# EAGLE design MJ808 clone - all driver- POC (EAGLE 9.4.0)
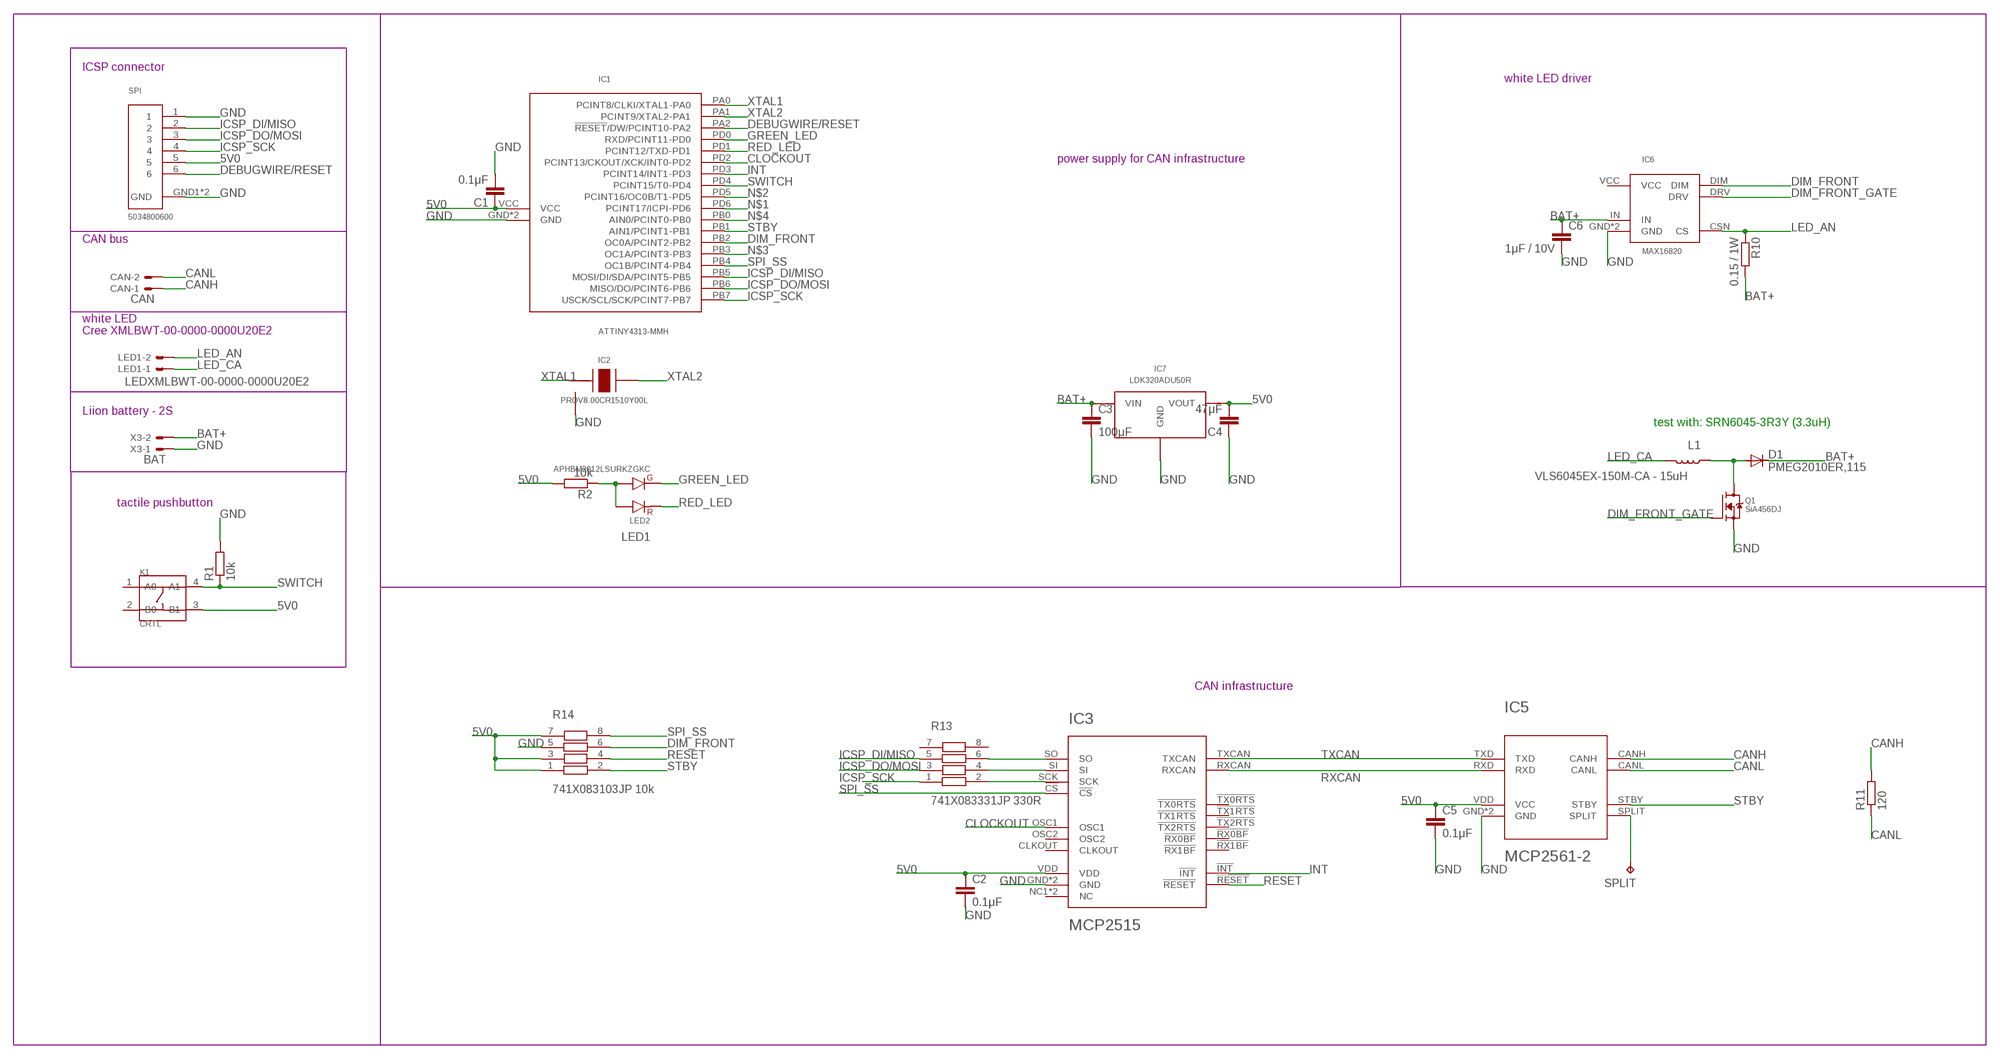
[diagram p0: schematic, sheet 1]

## Parts
C1  0.1μF  C-EUC0402  [C0402]
C2  0.1μF  C-EUC0402  [C0402]
C3  100μF  C-EUC1206  [C1206]
C4  47μF  C-EUC0805  [C0805]
C5  0.1μF  C-EUC0402  [C0402]
C6  1μF / 10V  C-EUC0805  [C0805]
CAN  CAN  22-23-2021  [22-23-2021]
D1  PMEG2010ER,115  DIODE-SOD123  [SOD123]
IC1  ATTINY4313-MMH  ATTINY4313VQFN-20  [VQFN-20]
IC2  PRQV8.00CR1510Y00L  PRQV  [SMT]
IC3  MCP2515  MCP2515-I-ML  [QFN20]
IC5  MCP2561-2  [DFN10]
IC6  MAX16820  [TDFN-6-EP]
IC7  LDK320ADU50R  LDO  [SOT-89]
K1  CRTL  SMD-SWITCH-TACTILE-SPST-NO(4P-D6.0MM)  [SW4-SMD-6.0X6.0X5.0MM]
L1  VLS6045EX-150M-CA - 15uH  INDUCTOR-SRN6045-33UH  [SRN6045]
LED1  LEDXMLBWT-00-0000-0000U20E2  22-23-2021  [22-23-2021]
LED2  APHBM2012LSURKZGKC  [SMD]
Q1  SiA456DJ  SIA456DJ  [SC-70-6]
R1  10k  R-EU_R0402  [R0402]
R2  10k  R-EU_R0402  [R0402]
R10  0.15 / 1W  R-EU_R1210  [R1210]
R11  120  R-EU_R0805  [R0805]
R13  741X083331JP 330R  741X083331JP  [0402]
R14  741X083103JP 10k  741X083331JP  [0402]
SPI  5034800600  [SMT]
SPLIT  TPB2,54  [B2,54]
X3  BAT  22-23-2021  [22-23-2021]

## Nets
5V0 [5V0_μC]: C1.1 C2.1 C4.2 C5.1 IC1.VCC IC3.VDD IC5.VDD(VCC) IC7.VOUT K1.3(B1) R2.2 R14.1 R14.3 R14.7 SPI.5
BAT+ [currett-0.45]: C3.1 C6.1 D1.C IC6.IN IC7.VIN R10.2 X3.2
CANH [signal]: CAN.1 IC5.CANH R11.2
CANL [signal]: CAN.2 IC5.CANL R11.1
CLOCKOUT [signal]: IC1.PD2(PCINT13/CKOUT/XCK/INT0-PD2) IC3.OSC1
DEBUGWIRE/RESET [signal]: IC1.PA2(!RESET!/DW/PCINT10-PA2) SPI.6
DIM_BRAKE_DRAIN: D1.A L1.1 Q1.D
DIM_FRONT [signal]: IC1.PB2(OC0A/PCINT2-PB2) IC6.DIM R14.6
DIM_FRONT_GATE [signal]: IC6.DRV Q1.G
GND: C1.2 C2.2 C3.2 C4.1 C5.2 C6.2 IC1.GND IC1.GND1(GND) IC2.GND IC3.GND IC3.GND6(GND) IC5.GND IC5.VSS(GND) IC6.GND IC6.GND1(GND) IC7.GND Q1.S R1.2 R14.5 SPI.1 SPI.GND1(GND) SPI.GND2(GND) X3.1
GREEN_LED [signal]: IC1.PD0(RXD/PCINT11-PD0) LED2.3
ICSP_DI/MISO [signal]: IC1.PB5(MOSI/DI/SDA/PCINT5-PB5) R13.5 SPI.2
ICSP_DO/MOSI [signal]: IC1.PB6(MISO/DO/PCINT6-PB6) R13.3 SPI.3
ICSP_SCK [signal]: IC1.PB7(USCK/SCL/SCK/PCINT7-PB7) R13.1 SPI.4
INT [signal]: IC1.PD3(PCINT14/INT1-PD3) IC3.!INT!
LED1 [signal]: LED2.1 LED2.4 R2.1
LED_AN [currett-0.45]: IC6.CSN(CS) LED1.2 R10.1
LED_CA: L1.2 LED1.1
N$1: IC1.PD6(PCINT17/ICPI-PD6)
N$2: IC1.PD5(PCINT16/OC0B/T1-PD5)
N$3: IC1.PB3(OC1A/PCINT3-PB3)
N$4: IC1.PB0(AIN0/PCINT0-PB0)
RED_LED [signal]: IC1.PD1(PCINT12/TXD-PD1) LED2.2
RESET [signal]: IC3.!RESET! R14.4
RXCAN [signal]: IC3.RXCAN IC5.RXD
SPI_MISO [signal]: IC3.SO R13.6
SPI_MOSI [signal]: IC3.SI R13.4
SPI_SCK [signal]: IC3.SCK R13.2
SPI_SS [signal]: IC1.PB4(OC1B/PCINT4-PB4) IC3.!CS! R14.8
SPLIT: IC5.SPLIT SPLIT.TP
STBY [signal]: IC1.PB1(AIN1/PCINT1-PB1) IC5.STBY R14.2
SWITCH [signal]: IC1.PD4(PCINT15/T0-PD4) K1.4(A1) R1.1
TXCAN [signal]: IC3.TXCAN IC5.TXD
XTAL1 [signal]: IC1.PA0(PCINT8/CLKI/XTAL1-PA0) IC2.XTAL1
XTAL2 [signal]: IC1.PA1(PCINT9/XTAL2-PA1) IC2.XTAL2
Unconnected: IC3.!RX0BF! IC3.!RX1BF! IC3.!TX0RTS! IC3.!TX1RTS! IC3.!TX2RTS! IC3.CLKOUT IC3.NC1(NC) IC3.NC2(NC) IC3.OSC2 K1.1(A0) K1.2(B0) R13.7 R13.8

## Notes on the sheet
- ICSP connector
- white LED driver
- power supply for CAN infrastructure
- CAN bus
- white LED
  Cree XMLBWT-00-0000-0000U20E2
- Liion battery - 2S
- test with: SRN6045-3R3Y (3.3uH)
- tactile pushbutton
- CAN infrastructure

## Power pins joined to a net without a drawn wire
VCC: IC6.VCC

## Library data of the parts
C1-C6 = rcl:C-EU: CAPACITOR, European symbol; SPICEPREFIX: C
CAN LED1 X3 = con-molex:22-23-2021: .100" (2.54mm) Center Header - 2 Pin; MF: MOLEX; MPN: 22-23-2021; OC_FARNELL: 1462926; OC_NEWARK: 25C3832
D1 = diode:DIODE-: DIODE
IC1 = ATtiny4313 microcontroller:ATTINY4313; SPICEPREFIX: X
IC2 = PRQV8.00CR1510Y00L - 8MHz resonator:PRQV
IC3 = MCP2515-I-ML - Standalonce CAN Controller with SPI Interface:MCP2515-I-ML
IC5 = MCP2561-2 - High-Speed CAN Transceiver:MCP2561-2
IC6 = MAX16820 LED Driver, constant current:MAX16820
IC7 = LDO SOT-89:LDO
K1 = Seeed-Switch:SMD-SWITCH-TACTILE-SPST-NO(4P-D6.0MM): 311020004; MPN: DTSM-62K-S-V-T/R(SN431)
L1 = SparkFun-Coils:INDUCTOR: Inductors Resist changes in electrical current. Basically a coil of wire. SparkFun Products: SparkFun Load Cell Amplifier - HX711 <https://www.sparkfun.com/products/13879> IOIO-OTG - V2.2 <https://www.sparkfun.com/products/13613>; PROD_ID: NDUC-11627; VALUE: 33µH/±20%/1.4A
LED2 = APHBM2012LSURKZGKC:APHBM2012LSURKZGKC
Q1 = SIA456DJ-T1-GE3  N-Fet:SIA456DJ
R1 R2 R10 R11 = rcl:R-EU_: RESISTOR, European symbol; SPICEPREFIX: R
R13 R14 = 74x-1133528 Resistor Array:741X083331JP
SPI = 5034800600 FPC Connector:5034800600
SPLIT = testpad:TP: Test pad

## Net classes
0 GND: width 0.254 mm, drill 0.254 mm, clearance 0.127 mm
1 VCC: width 0.254 mm, drill 0.254 mm, clearance 0.127 mm
2 signal: width 0.127 mm, drill 0.254 mm, clearance 0.127 mm
3 5V0CAN: width 0.3 mm, drill 0.35 mm, clearance 0.2 mm
4 5V0_μC: width 0.25 mm, drill 0.25 mm, clearance 0.2 mm
5 currett-0.45: width 0.45 mm, drill 0.35 mm, clearance 0.2 mm

## Board
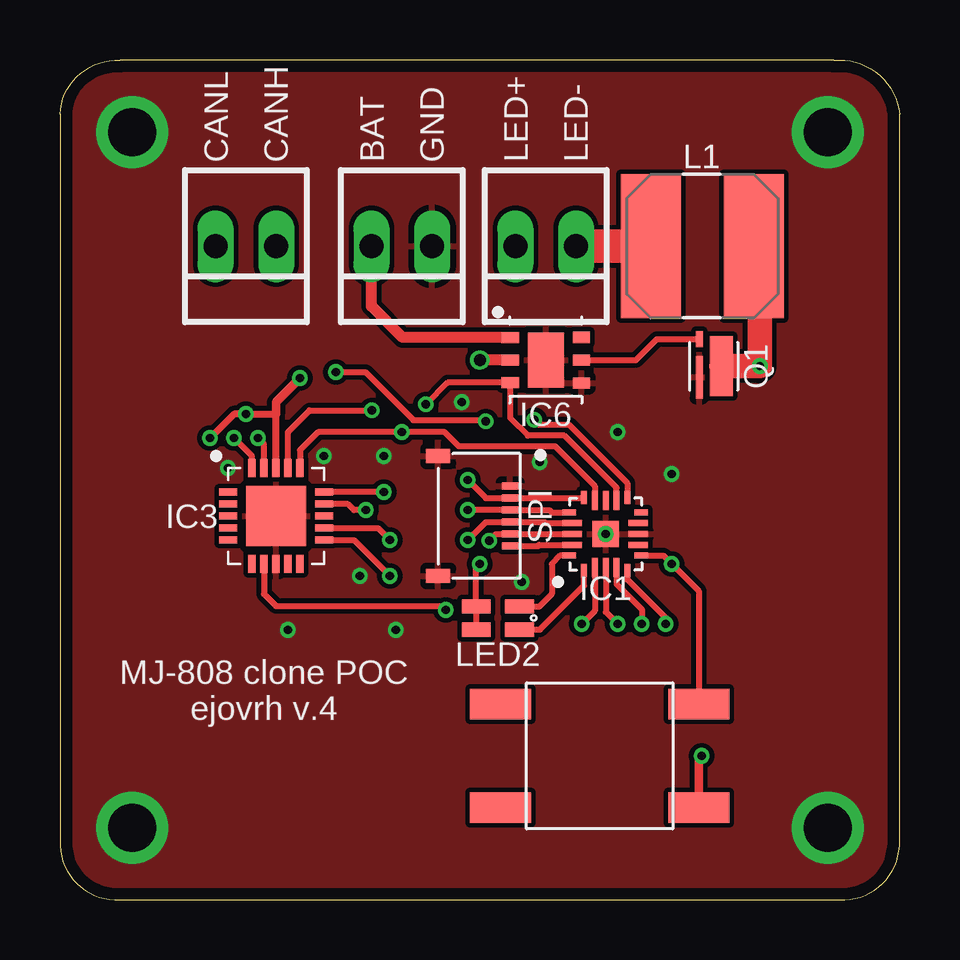
[diagram p1: board, top side]
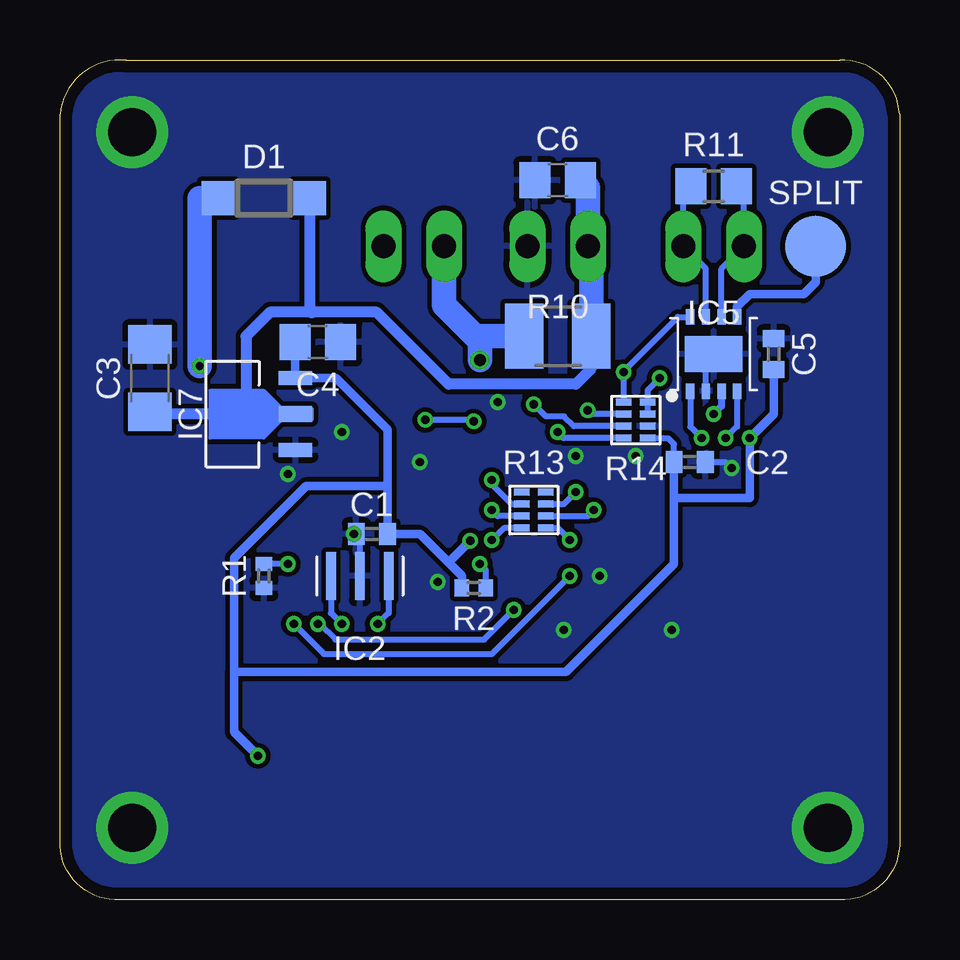
[diagram p2: board, bottom side, seen from below]

Size 35 x 35.01 mm. Coordinates in mm from the lower left corner, seen from the top.
Outline: 2.5,0 32.5,0
Outline: 35,2.25 35,32.75
Outline: 32.25,35 2.5,35 arc90 0,32.75 0,2.25
Outline: 32.25,35 arc-90 35,32.75
Outline: 32.5,0 arc90 35,2.25
Outline: 0,2.25 arc90 2.5,0
Outline: 32.25,35 arc-90 35,32.75
Outline: 32.5,0 arc90 35,2.25
Outline: 0,2.25 arc90 2.5,0
Copper layers (1*16): Top 0.035mm / dielectric 1.5mm / Bottom 0.035mm
Design rules "markovac_2layer": minimum track width 0.2mm, minimum drill 0.35mm, track to track 0.2mm, track to pad 0.2mm, pad to pad 0.2mm, via to via 0.2mm, smd to smd 0.2mm, copper to edge 0.5mm, drill to drill 8mil, minimum pad ring 0.15mm, minimum via ring 0.15mm, stop-mask expansion 4mil, vias tented up to drill 0.35mm, thermal gap 10mil

### Footprints (pad centres in the part's own frame; a part is rotated, then mirrored left to right if it is on the bottom)
C0402 = smd 0.7 x 0.9: 1 -0.65,0; 2 0.65,0
C1206 = smd 1.6 x 1.8: 1 -1.4,0; 2 1.4,0
C0805 = smd 1.3 x 1.5: 1 -0.95,0; 2 0.95,0
22-23-2021 = drill 1 long: 1 -1.27,0; 2 1.27,0
SOD123 = smd 1.4 x 1.4: A 1.9,0; C -1.9,0
VQFN-20 = smd 1.1 x 1.1: GND 0,0 | smd 0.25 x 0.8: GND1 0,-1.35; PA2 -0.45,1.4; PB7 0.45,1.4; PD5 -0.45,-1.35; PD6 0.45,-1.35; VCC 0,1.4 | smd 0.8 x 0.25: PA0 -1.4,0; PA1 -1.4,0.45; PB2 1.4,-0.45; PB3 1.4,0; PB4 1.4,0.45; PD2 -1.4,-0.45 | smd 0.25 x 0.55: PB0 0.9,-1.48; PB6 0.9,1.52; PD0 -0.9,1.52; PD4 -0.9,-1.48 | smd 0.55 x 0.25: PB1 1.52,-0.9; PB5 1.52,0.9; PD1 -1.52,0.9; PD3 -1.52,-0.9
SMT = smd 0.4 x 2: GND 0,0; XTAL1 -1.2,0; XTAL2 1.2,0
QFN20 = smd 0.3 x 0.75: !CS! 1,2; !RESET! 0.5,2; !RX0BF! 1,-2; !RX1BF! 0.5,-2; GND6 0,-2; OSC1 -0.5,-2; OSC2 -1,-2; RXCAN -1,2; TXCAN -0.5,2; VDD 0,2 | smd 0.75 x 0.3: !INT! 2,-1; !TX0RTS! -2,0.5; !TX1RTS! -2,0; !TX2RTS! -2,-1; CLKOUT -2,1; NC1 -2,-0.5; NC2 2,0; SCK 2,-0.5; SI 2,0.5; SO 2,1 | smd 2.5 x 2.5: GND 0,0
DFN10 = smd 0.35 x 0.65: CANH -0.325,1.55; CANL 0.325,1.55; RXD 0.975,-1.55; SPLIT 0.975,1.55; STBY -0.975,1.55; TXD -0.975,-1.55; VDD 0.325,-1.55; VSS -0.325,-1.55 | smd 2.4 x 1.5: GND 0,0
TDFN-6-EP = smd 0.71 x 0.46: CSN -1.48,0; DIM -1.48,-0.94; DRV 1.48,0; GND1 1.48,-0.95; IN -1.48,0.94; VCC 1.48,0.95 | smd 1.5 x 2.3: GND 0,0
SOT-89 = smd 0.57 x 1.4: GND -1.5,0.685; VOUT 1.5,0.685 | smd 0.65 x 1.4: VIN 0,0.685
SW4-SMD-6.0X6.0X5.0MM = smd 2.54 x 1.27: 1 -4.129,2.159; 2 -4.129,-2.159; 3 4.129,-2.159; 4 4.129,2.159
SRN6045 = smd 2.5 x 6: 1 -2.175,0; 2 2.125,0
SMD = smd 1.2 x 0.6: 1 0.9,0.48; 2 -0.9,0.48; 3 -0.9,-0.48; 4 0.9,-0.48
SC-70-6 = smd 0.95 x 2.5: D -0.326,-0.004 | smd 0.3 x 0.65: G 0.597,-1.126 | smd 0.3 x 1.77: S 0.6,0.463
R0402 = smd 0.6 x 0.7: 1 -0.5,0; 2 0.5,0
R1210 = smd 1.6 x 2.7: 1 -1.4,0; 2 1.4,0
R0805 = smd 1.3 x 1.5: 1 -0.95,0; 2 0.95,0
0402 = smd 0.65 x 0.3: 1 -0.5,-0.75; 2 0.5,-0.75; 3 -0.5,-0.25; 4 0.5,-0.25; 5 -0.5,0.25; 6 0.5,0.25; 7 -0.5,0.75; 8 0.5,0.75
SMT' = smd 0.3 x 0.7: 1 -1.25,1.27; 2 -0.75,1.27; 3 -0.25,1.27; 4 0.25,1.27; 5 0.75,1.27; 6 1.25,1.27 | smd 0.6 x 1: GND1 -2.5,-1.73; GND2 2.5,-1.73
B2,54 = smd 2.54 x 2.54: TP 0,0

### Placement (x,y rotation side)
C1  22,15.25 180 bottom
C2  8.75,18.25 0 bottom
C3  31.25,21.75 90 bottom
C4  24.25,23.25 180 bottom
C5  5.25,22.75 90 bottom
C6  14.25,30 180 bottom
CAN  7.75,27.25 180 top
D1  26.5,29.25 180 bottom
IC1  22.75,15.25 90 top
IC2  22.5,13.5 0 bottom
IC3  9,16 0 top
IC5  7.75,22.75 0 bottom
IC6  20.25,22.5 0 top
IC7  24.5,20.25 90 bottom
K1  22.5,6 0 top
L1  26.75,27.25 180 top
LED1  20.25,27.25 180 top
LED2  18.25,11.75 180 top
Q1  27.25,22.25 180 top
R1  26.5,13.5 270 bottom
R2  17.75,13 180 bottom
R10  14.25,23.5 0 bottom
R11  7.75,29.75 180 bottom
R13  15.25,16.25 0 bottom
R14  11,20 180 bottom
SPI  5034800600  [SMT']  17.5,16 270 top
SPLIT  3.5,27.25 0 bottom
X3  14.25,27.25 180 top

### Tracks (layer width: path | path; a pad name or v marks a point on that pad's centre or on a via)
5V0  (via drill 0.35)
  Top 0.25: C1.1 SPI.5 18.17,15.25 v17.89,14.98
  Top 0.3: v6.25,19.25 7.25,20.25 v7.75,20.25 9,20.25 IC3.VDD
  Top 0.35: K1.3 26.63,5.88 v26.75,6 | v10,21.75 9,20.75 9,20.25
  Bottom 0.25: C2.1 9.4,19 9.65,19.25 R14.7 | R14.3 R14.1 10.5,21.25 v10,21.75
  Bottom 0.3: IC5.VDD 7.42,20.58 v7.75,20.25
  Bottom 0.35: R2.2 18.25,13.5 18.75,14 | 18.75,14 20,15.25 C1.1 21.35,17.25 | 18.75,14 18.75,14.12 v17.89,14.98 | v26.75,6 27.75,7 27.75,9.5 | 9.4,16.75 6.25,16.75 v6.25,19.25 5.25,20.25 C5.1 | 9.4,16.75 C2.1 | 9.4,16.75 9.4,14 13.9,9.5 27.75,9.5 | C4.2 25.2,21.77 | IC7.VOUT 23.5,21.75 21.35,19.6 21.35,17.25 | 21.35,17.25 24.75,17.25 27.75,14.25 27.75,9.5
  Bottom 0.45: 25.2,21.77 IC7.VOUT
BAT+
  Top 0.45: X3.2 12.98,24.75 14.29,23.44 IC6.IN
  Bottom 0.45: R10.2 12.85,22.15 13.5,21.5 18.79,21.5 21.79,24.5 24.5,24.5 26.25,24.5 27.25,23.5 27.25,20.25 | IC7.VIN 27.25,20.25 | 27.25,20.25 31.15,20.25 C3.1 | D1.C 24.6,24.6
  Bottom 0.508: 24.6,24.6 24.5,24.5
  Bottom 1.016: R10.2 12.85,27.12 X3.2 12.98,29.68 C6.1
CANH
  Bottom 0.25: R11.2 9.02,29.75 CAN.1 8.07,26.31 IC5.CANH
CANL
  Bottom 0.25: R11.1 6.48,29.75 CAN.2 7.42,26.31 IC5.CANL
CLOCKOUT  (via drill 0.35)
  Top 0.25: IC1.PD2 23.2,13.17 24.25,12.12 v24.25,11.5 | v16.09,12.09 15.92,12.25 9,12.25 8.5,12.75 IC3.OSC1
  Bottom 0.25: v24.25,11.5 24.17,11.5 23.52,10.85 17.32,10.85 v16.09,12.09
DEBUGWIRE/RESET
  Top 0.25: SPI.6 19.93,14.75 19.98,14.8 IC1.PA2
DIM_BRAKE_DRAIN  (via drill 0.35)
  Top 0.5: 28.93,26.5 L1.1
  Top 1.016: 28.93,26.5 29.18,26.5 v29.18,22.25 v29.18,22.26 Q1.D
  Bottom 0.254: D1.A 29.18,29.25
  Bottom 1.016: 29.18,29.25 v29.18,22.25
DIM_FRONT  (via drill 0.35)
  Top 0.25: IC6.DIM 18.77,21.5 | IC1.PB2 23.2,17.19 21.03,19.36 19.5,19.36 18.77,20.09 IC6.DIM | IC6.DIM 16.16,21.56 v15.25,20.65
  Bottom 0.25: R14.6 13.58,19.75 13.98,20.15 14.75,20.15 v15.25,20.65
DIM_FRONT_GATE
  Top 0.25: 22.61,22.5 IC6.DRV 24,22.5 24.88,23.38 Q1.G 25.38,23.38
GND  (via drill 0.35, 2)
  Bottom 0.25: IC2.GND 22.5,15.1 C1.2 | IC5.VSS 8.07,22.25 | C2.2 7.25,18.25 v7,18
  Bottom 0.35: IC5.GND 7.75,22.58 8.07,22.25
  other vias: 3,32 3,3 32,3 32,32 25.5,17.75 19.25,13.25 20,18.25 12.5,13.5 13.5,18.5 11,18.5 22.75,15.25 9.5,11.25 14,11.25 23.25,19.5 16.75,20.75
  pour Top: 0,35 35,35 35,0 0,0
  pour Bottom: 0,35 0,0 35,0 35,35
GREEN_LED
  Top 0.25: LED2.3 19.98,12.23 20.5,12.75 20.5,14 20.85,14.35 IC1.PD0
ICSP_DI/MISO  (via drill 0.35)
  Top 0.25: IC1.PB5 21.83,16.75 SPI.2 17.75,16.75 v17,17.5
  Bottom 0.25: R13.5 16.18,16.5 17,17.32 v17,17.5
ICSP_DO/MOSI  (via drill 0.35)
  Top 0.25: IC1.PB6 20.5,16.15 20.4,16.25 SPI.3 v17,16.25
  Bottom 0.25: R13.3 16.75,16 v17,16.25
ICSP_SCK  (via drill 0.35)
  Top 0.25: IC1.PB7 20.25,15.7 20.2,15.75 SPI.4 17.75,15.75 v17,15
  Bottom 0.25: R13.1 16.5,15.5 v17,15
INT  (via drill 0.35)
  Top 0.25: IC3.!INT! 12.25,15 v13.75,13.5 | IC1.PD3 23.65,13.35 25.25,11.75 v25.25,11.5
  Bottom 0.25: v13.75,13.5 17,10.25 24,10.25 v25.25,11.5
LED1  (via drill 0.35)
  Top 0.25: LED2.1 LED2.4 17.35,13.85 v17.5,14
  Bottom 0.25: R2.1 17.25,13.75 v17.5,14
LED_AN  (via drill 0.5)
  Top 0.45: IC6.CSN v17.5,22.5
  Bottom 0.5: v17.5,22.5 17.25,22.75 17.25,23.5
  Bottom 1.016: R10.1 17.25,23.5 17.69,23.5 | LED1.2 18.98,24.79 17.69,23.5 | v17.5,22.5 17.5,23.31 17.69,23.5
LED_CA
  Top 1.4: LED1.1 L1.2
RED_LED
  Top 0.25: IC1.PD1 21.85,13.1 20.02,11.27 LED2.2
RESET  (via drill 0.35)
  Top 0.25: IC3.!RESET! 9.5,19.5 10.4,20.4 v13,20.4
  Bottom 0.25: R14.4 12.85,20.25 v13,20.4
RXCAN  (via drill 0.35)
  Top 0.25: IC3.RXCAN 8,18.5 v7.25,19.25
  Bottom 0.25: IC5.RXD 6.78,19.73 v7.25,19.25
SPI_MISO  (via drill 0.35)
  Top 0.25: v13.5,17 IC3.SO
  Bottom 0.25: R13.6 14,16.5 v13.5,17
SPI_MOSI  (via drill 0.35)
  Top 0.25: v12.75,16.25 12.25,16.25 12,16.5 IC3.SI
  Bottom 0.25: R13.4 13,16 v12.75,16.25
SPI_SCK  (via drill 0.35)
  Top 0.25: IC3.SCK 13.25,15.5 v13.75,15
  Bottom 0.25: R13.2 14.25,15.5 v13.75,15
SPI_SS  (via drill 0.35)
  Top 0.25: IC3.!CS! 10,18.75 10.75,19.5 v14.25,19.5 16.03,19.5 16.63,18.9 20.65,18.9 22.3,17.25 IC1.PB4
  Bottom 0.25: R14.8 14,19.25 v14.25,19.5
SPLIT
  Bottom 0.35: IC5.SPLIT 6.78,24.73 6.25,25.25 4,25.25 3.5,25.75 SPLIT.TP
STBY  (via drill 0.35)
  Top 0.25: v19.77,20.01 19.97,19.81 20.5,19.81 21.21,19.81 23.65,17.37 IC1.PB1 | 17.69,20 14.73,20 12.73,22 v11.5,22
  Top 0.254: v17.75,19.94 17.69,20
  Bottom 0.25: IC5.STBY 9.25,24.3 11.5,22.05 v11.5,22 R14.2
  Bottom 0.254: v17.75,19.94 17.82,20.01 v19.77,20.01
SWITCH  (via drill 0.35)
  Top 0.25: IC1.PD4 25.15,14.35 v25.5,14 26.63,12.87 K1.4
  Bottom 0.25: v25.5,14 R1.1
TXCAN  (via drill 0.35)
  Top 0.25: IC3.TXCAN 8.5,19 v8.25,19.25
  Bottom 0.25: IC5.TXD 8.72,19.73 v8.25,19.25
XTAL1  (via drill 0.35)
  Top 0.25: IC1.PA0 22.75,12 v23.25,11.5
  Bottom 0.25: IC2.XTAL1 23.7,11.95 v23.25,11.5
XTAL2  (via drill 0.35)
  Top 0.25: IC1.PA1 22.3,12.05 v21.75,11.5
  Bottom 0.25: IC2.XTAL2 21.3,11.95 v21.75,11.5

### Text on the board
tPlace: BAT | GND | LED+ | LED- | MJ-808 clone POC / ejovrh v.4
tNames: CANL | CANH